# Altium schematic sheet Solars.SchDoc: Solar panels analog interface
size A2; Author: G. Gajoch, M. Gumiela; DocumentNumber: 12; SheetNumber: 12; SheetTotal: 16; Rshunt: 15; Model: EM1; PageSetup: Record=PageOptions|CenterHorizontal=True|CenterVertical=True|PrintScale=0.52|XCorrection=1.00|YCorrection=1.00|PrintKind=1|BorderSize=5000000|LeftOffset=0|BottomOffset=0|Orientation=2|PaperLength=4200|PaperWidth=2970|Scale=100|PaperSource=7|PrintQuality=600|MediaType=1|DitherType=10|PaperKind=A3|PrintScaleMode=1
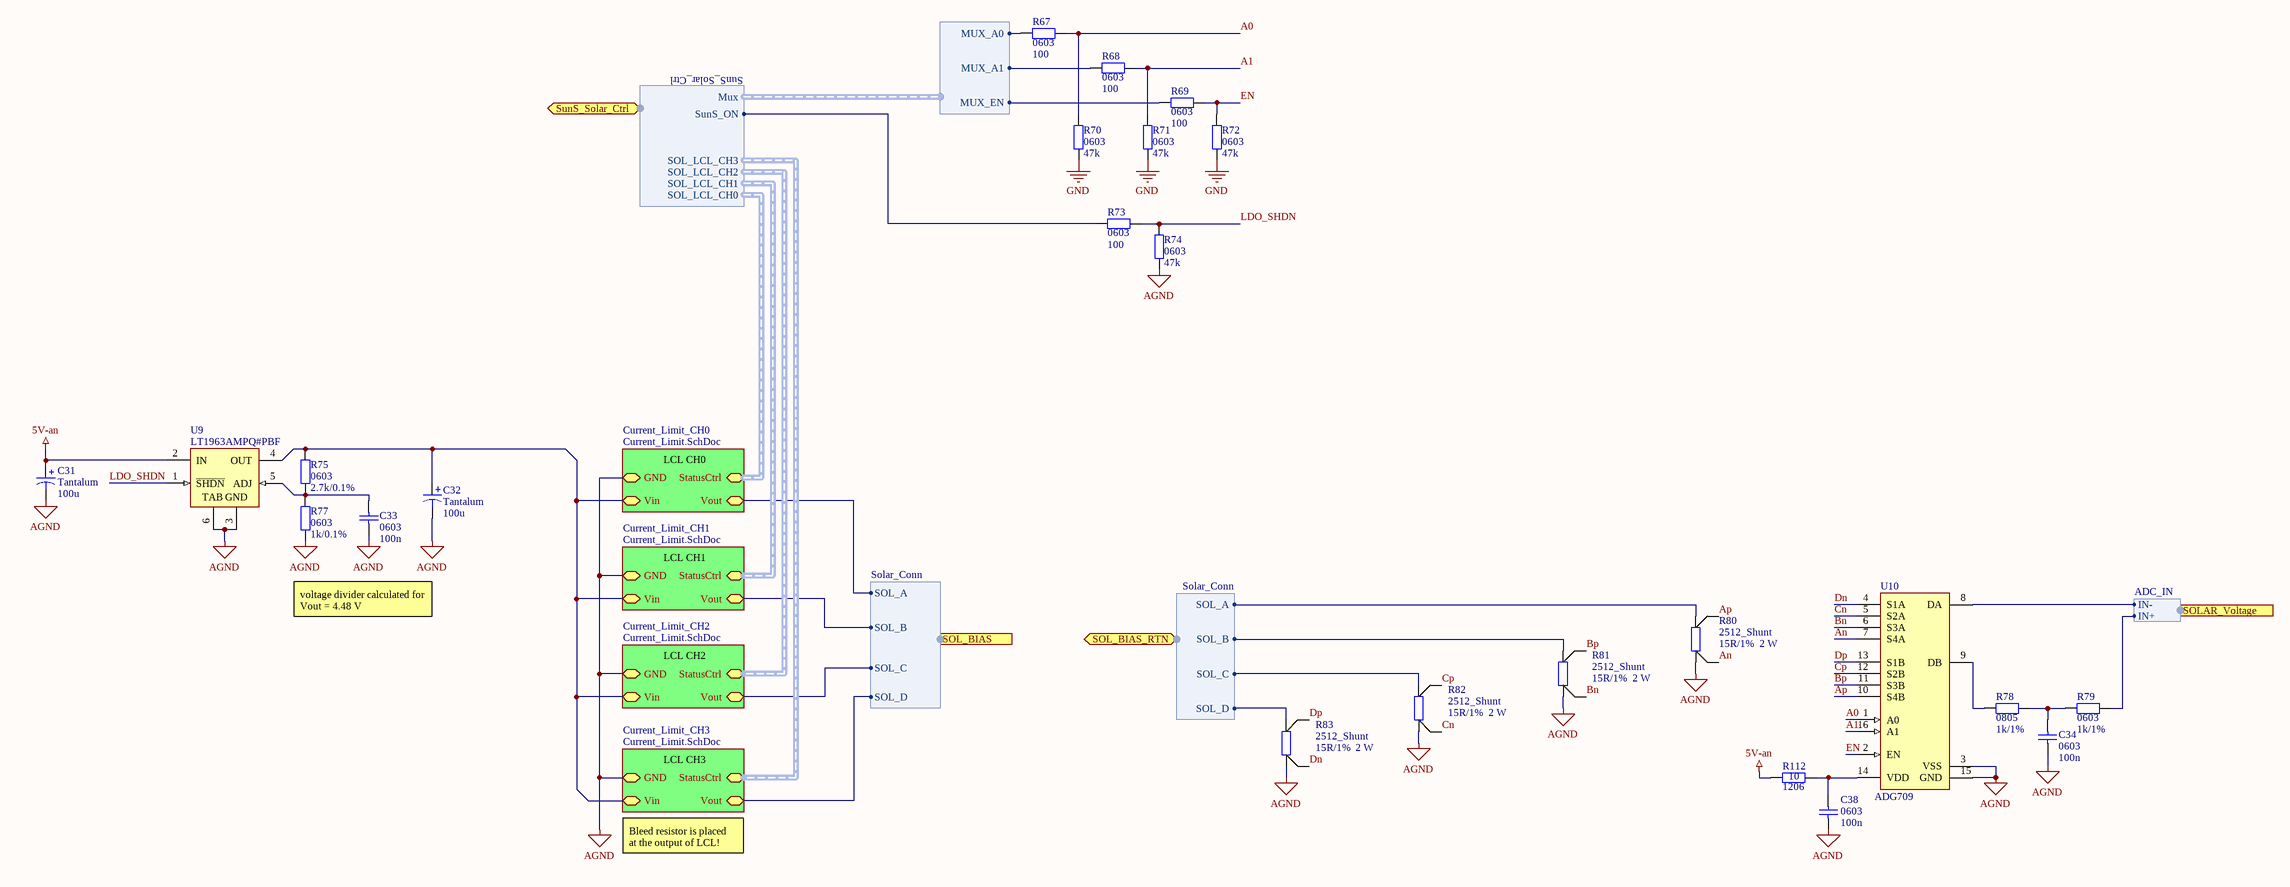
[diagram p0: Solars.SchDoc]

## Parts
C31  Tantalum  value 100u  [Tantalum_cap_D]
C32  Tantalum  value 100u  [Tantalum_cap_D]
C33  0603  value 100n  [SMD_Capacitor_0603]
C34  0603  value 100n  [SMD_Capacitor_0603]
C38  0603  value 100n  [SMD_Capacitor_0603]
R67  0603  value 100  [SMD_Resistor_0603]
R68  0603  value 100  [SMD_Resistor_0603]
R69  0603  value 100  [SMD_Resistor_0603]
R70  0603  value 47k  [SMD_Resistor_0603]
R71  0603  value 47k  [SMD_Resistor_0603]
R72  0603  value 47k  [SMD_Resistor_0603]
R73  0603  value 100  [SMD_Resistor_0603]
R74  0603  value 47k  [SMD_Resistor_0603]
R75  0603  value 2.7k/0.1%  [SMD_Resistor_0603]
R77  0603  value 1k/0.1%  [SMD_Resistor_0603]
R78  0805  value 1k/1%  [SMD_Resistor_0805]
R79  0603  value 1k/1%  [SMD_Resistor_0603]
R80  Power Rating: 2 W  Package: 2512_Shunt  [SMD_Resistor-shunt_2512]  (hidden comment: 15R/1%)
R81  Power Rating: 2 W  Package: 2512_Shunt  [SMD_Resistor-shunt_2512]  (hidden comment: 15R/1%)
R82  Power Rating: 2 W  Package: 2512_Shunt  [SMD_Resistor-shunt_2512]  (hidden comment: 15R/1%)
R83  Power Rating: 2 W  Package: 2512_Shunt  [SMD_Resistor-shunt_2512]  (hidden comment: 15R/1%)
R112  1206  value 10  [SMD_Resistor_1206]
U9  LT1963AMPQ#PBF  [LT-Q-5_N]
U10  ADG709  [TSSOP16]

## Sub-sheets
Current_Limit_CH0 = Current_Limit.SchDoc: GND, Vout, StatusCtrl (harness LCL_StatCtrl), Vin
Current_Limit_CH1 = Current_Limit.SchDoc: GND, Vout, StatusCtrl (harness LCL_StatCtrl), Vin
Current_Limit_CH2 = Current_Limit.SchDoc: GND, Vout, StatusCtrl (harness LCL_StatCtrl), Vin
Current_Limit_CH3 = Current_Limit.SchDoc: GND, Vout, StatusCtrl (harness LCL_StatCtrl), Vin

## Ports
SOL_BIAS (harness Solar_Conn), SOL_BIAS_RTN (harness Solar_Conn), SOLAR_Voltage (harness ADC_IN), SunS_Solar_Ctrl (harness SunS_Solar_Ctrl)

## Harnesses
MUX_Control: MUX_A0, MUX_A1, MUX_EN
SunS_Solar_Ctrl: Mux, SunS_ON, SOL_LCL_CH0, SOL_LCL_CH1, SOL_LCL_CH2, SOL_LCL_CH3
ADC_IN: IN+, IN-
Solar_Conn: SOL_A, SOL_B, SOL_C, SOL_D

## Nets
5V-an: C31.1 R112.2 U9.2(IN)
AGND: C31.2 C32.2 C33.1 C34.1 C38.1 R74.2 R77.2 R80.1 R81.1 R82.1 R83.1 U9.3(GND) U9.6(TAB) U10.3(VSS) U10.15(GND) ; sheet Current_Limit_CH0/GND, sheet Current_Limit_CH1/GND, sheet Current_Limit_CH2/GND, sheet Current_Limit_CH3/GND
GND: R70.2 R71.2 R72.2
A0: R67.1 R70.1 U10.1(A0)
A1: R68.1 R71.1 U10.16(A1)
An: R80.2 U10.7(S4A)
Ap: R80.3 U10.10(S4B)
Bn: R81.2 U10.6(S3A)
Bp: R81.3 U10.11(S3B)
Cn: R82.2 U10.5(S2A)
Cp: R82.3 U10.12(S2B)
Dn: R83.2 U10.4(S1A)
Dp: R83.3 U10.13(S1B)
EN: R69.1 R72.1 U10.2(EN)
LDO_SHDN: R73.1 R74.1 U9.1(~{SHDN})
NetC32_1: C32.1 R75.2 U9.4(OUT) ; sheet Current_Limit_CH0/Vin, sheet Current_Limit_CH1/Vin, sheet Current_Limit_CH2/Vin, sheet Current_Limit_CH3/Vin
NetC33_2: C33.2 R75.1 R77.1 U9.5(ADJ)
NetC34_2: C34.2 R78.2 R79.1
NetC38_2: C38.2 R112.1 U10.14(VDD)
NetR67_2: R67.2 ; harness MUX_Control.MUX_A0
NetR68_2: R68.2 ; harness MUX_Control.MUX_A1
NetR69_2: R69.2 ; harness MUX_Control.MUX_EN
NetR73_2: R73.2 ; port SunS_Solar_Ctrl.SunS_ON
NetR78_1: R78.1 U10.9(DB)
NetR79_2: R79.2 ; port SOLAR_Voltage.IN+
NetR80_4: R80.4 ; port SOL_BIAS_RTN.SOL_A
NetR81_4: R81.4 ; port SOL_BIAS_RTN.SOL_B
NetR82_4: R82.4 ; port SOL_BIAS_RTN.SOL_C
NetR83_4: R83.4 ; port SOL_BIAS_RTN.SOL_D
NetU10_8: U10.8(DA) ; port SOLAR_Voltage.IN-
(unnamed): sheet Current_Limit_CH0/Vout, port SOL_BIAS.SOL_A
(unnamed): sheet Current_Limit_CH1/Vout, port SOL_BIAS.SOL_B
(unnamed): sheet Current_Limit_CH2/Vout, port SOL_BIAS.SOL_C
(unnamed): sheet Current_Limit_CH3/Vout, port SOL_BIAS.SOL_D

## Notes on the sheet
- LCL CH0
- LCL CH1
- voltage divider calculated for Vout = 4.48 V
- LCL CH2
- LCL CH3
- Bleed resistor is placed
  at the output of LCL!
- Title:
- Sheet:
- of
- Author:
- Model:
- File name:
- Document Number:
- Checked by:
- Iss-Rev:
- Approved by:
- Date:

## Library data of the parts
C31 C32 = Cap Pol1: Polarized Capacitor (Radial); Published: 8-Jun-2000; LatestRevisionDate: 17-Jul-2002; LatestRevisionNote: Re-released for DXP Platform.; PackageReference: RB7.6-15; Publisher: Altium Limited; PackageDescription: Polarized Capacitor (Radial); 2 Leads
C33 C34 = Cap: Capacitor; Published: 8-Jun-2000; LatestRevisionDate: 17-Jul-2002; LatestRevisionNote: Re-released for DXP Platform.; PackageReference: RAD-0.3; Publisher: Altium Limited; PackageDescription: Radial Cap, Thru-Hole; 2 Leads; 0.3 in Pin Spacing
C38 = Cap1: Capacitor; Published: 8-Jun-2000; LatestRevisionDate: 17-Jul-2002; LatestRevisionNote: Re-released for DXP Platform.; PackageReference: RAD-0.3; Publisher: Altium Limited; PackageDescription: Radial Cap, Thru-Hole; 2 Leads; 0.3 in Pin Spacing
R67-R75 R77-R79 R112 = Res2: Resistor; Published: 8-Jun-2000; LatestRevisionDate: 17-Jul-2002; LatestRevisionNote: Re-released for DXP Platform.; PackageReference: AXIAL-0.4; Publisher: Altium Limited; PackageDescription: Axial Device, Thru-Hole; 2 Leads; 0.4 in Pin Spacing
R80-R83 = 352115RFT: TE CONNECTIVITY  352115RFT  RESISTOR, 2512, 2W, 15R, 1%; Temperature Coefficient: ± 100ppm/°C; Manufacturer: TE CONNECTIVITY; ManufacturerPartNumber: 352115RFT; Farnell: http://pl.farnell.com/te-connectivity/352115rft/resistor-2512-2w-15r-1/dp/2117454; Manufacturer's Datasheet: http://www.farnell.com/datasheets/1610601.pdf; Value: 15R/1%
U9 = LT1963AMPQ#PBF: 1.5 A, Low Noise, Fast Transient Response LDO Regulator, 2.1 to 20 V Vin, Adjustable Vout, 5-pin DPAK (Q-5), -55 to 125 degC, Pb-Free; Manufacturer: Linear Technology; Discrete Pass Element: no; Dropout Voltage(V): 0.34; Iout(mA): 1500; Isupply(mA): 1; Noise(uV): 40; Output Voltage: Adj; PSRR(dB): 63; Shutdown Current(uA): 0.01; Vin Max(V): 20; Vin Min(V): 2.1; Vout Min(V): 1.21; DatasheetVersion: Rev. E; PackageVersion: Rev. F, 09/2011; PackageReference: Q-5; PackageDescription: 5-Pin Plastic DD Pak, Body 10.2235 x 8.89 mm, Pitch 1.702 mm; Supplier 1: Digi-Key; Supplier Part Number 1: LT1963AMPQ#PBF-ND; Supplier 2: Farnell; Supplier Part Number 2: 1839225; Supplier 3: Newark; Supplier Part Number 3: 15N5477; Number of Outputs: 1; RoHS: TRUE; Vout Max(V): 20; Mounting Technology: Surface Mount; PartNumber: LT1963AMPQ#PBF; ComponentLink1Description: Manufacturer URL; ComponentLink1URL: http://www.linear.com/; ComponentLink2Description: Datasheet; ComponentLink2URL: http://cds.linear.com/docs/en/datasheet/1963afe.pdf; ComponentLink3Description: Package Specification; ComponentLink3URL: http://cds.linear.com/docs/en/packaging/Q%20DD5%2005-08-1461%20Rev%20F.pdf
U10 = ADG709: CMOS Analog 4-Channel Multiplexer; Manufacturer: Analog Devices; ManufacturerPartNumber: ADG709